# EasyEDA Pro project 高性能信号源.epro

# Schematic Schematic1

## Sheets
1 信号通路: Create Date: 2024-10-18; Page Name: 信号通路; Project Name: 高性能信号源; Schematic Name: Schematic1; Update Date: 2024-10-21; Company: 嘉立创EDA; Page Size: A4; Version: V1.0
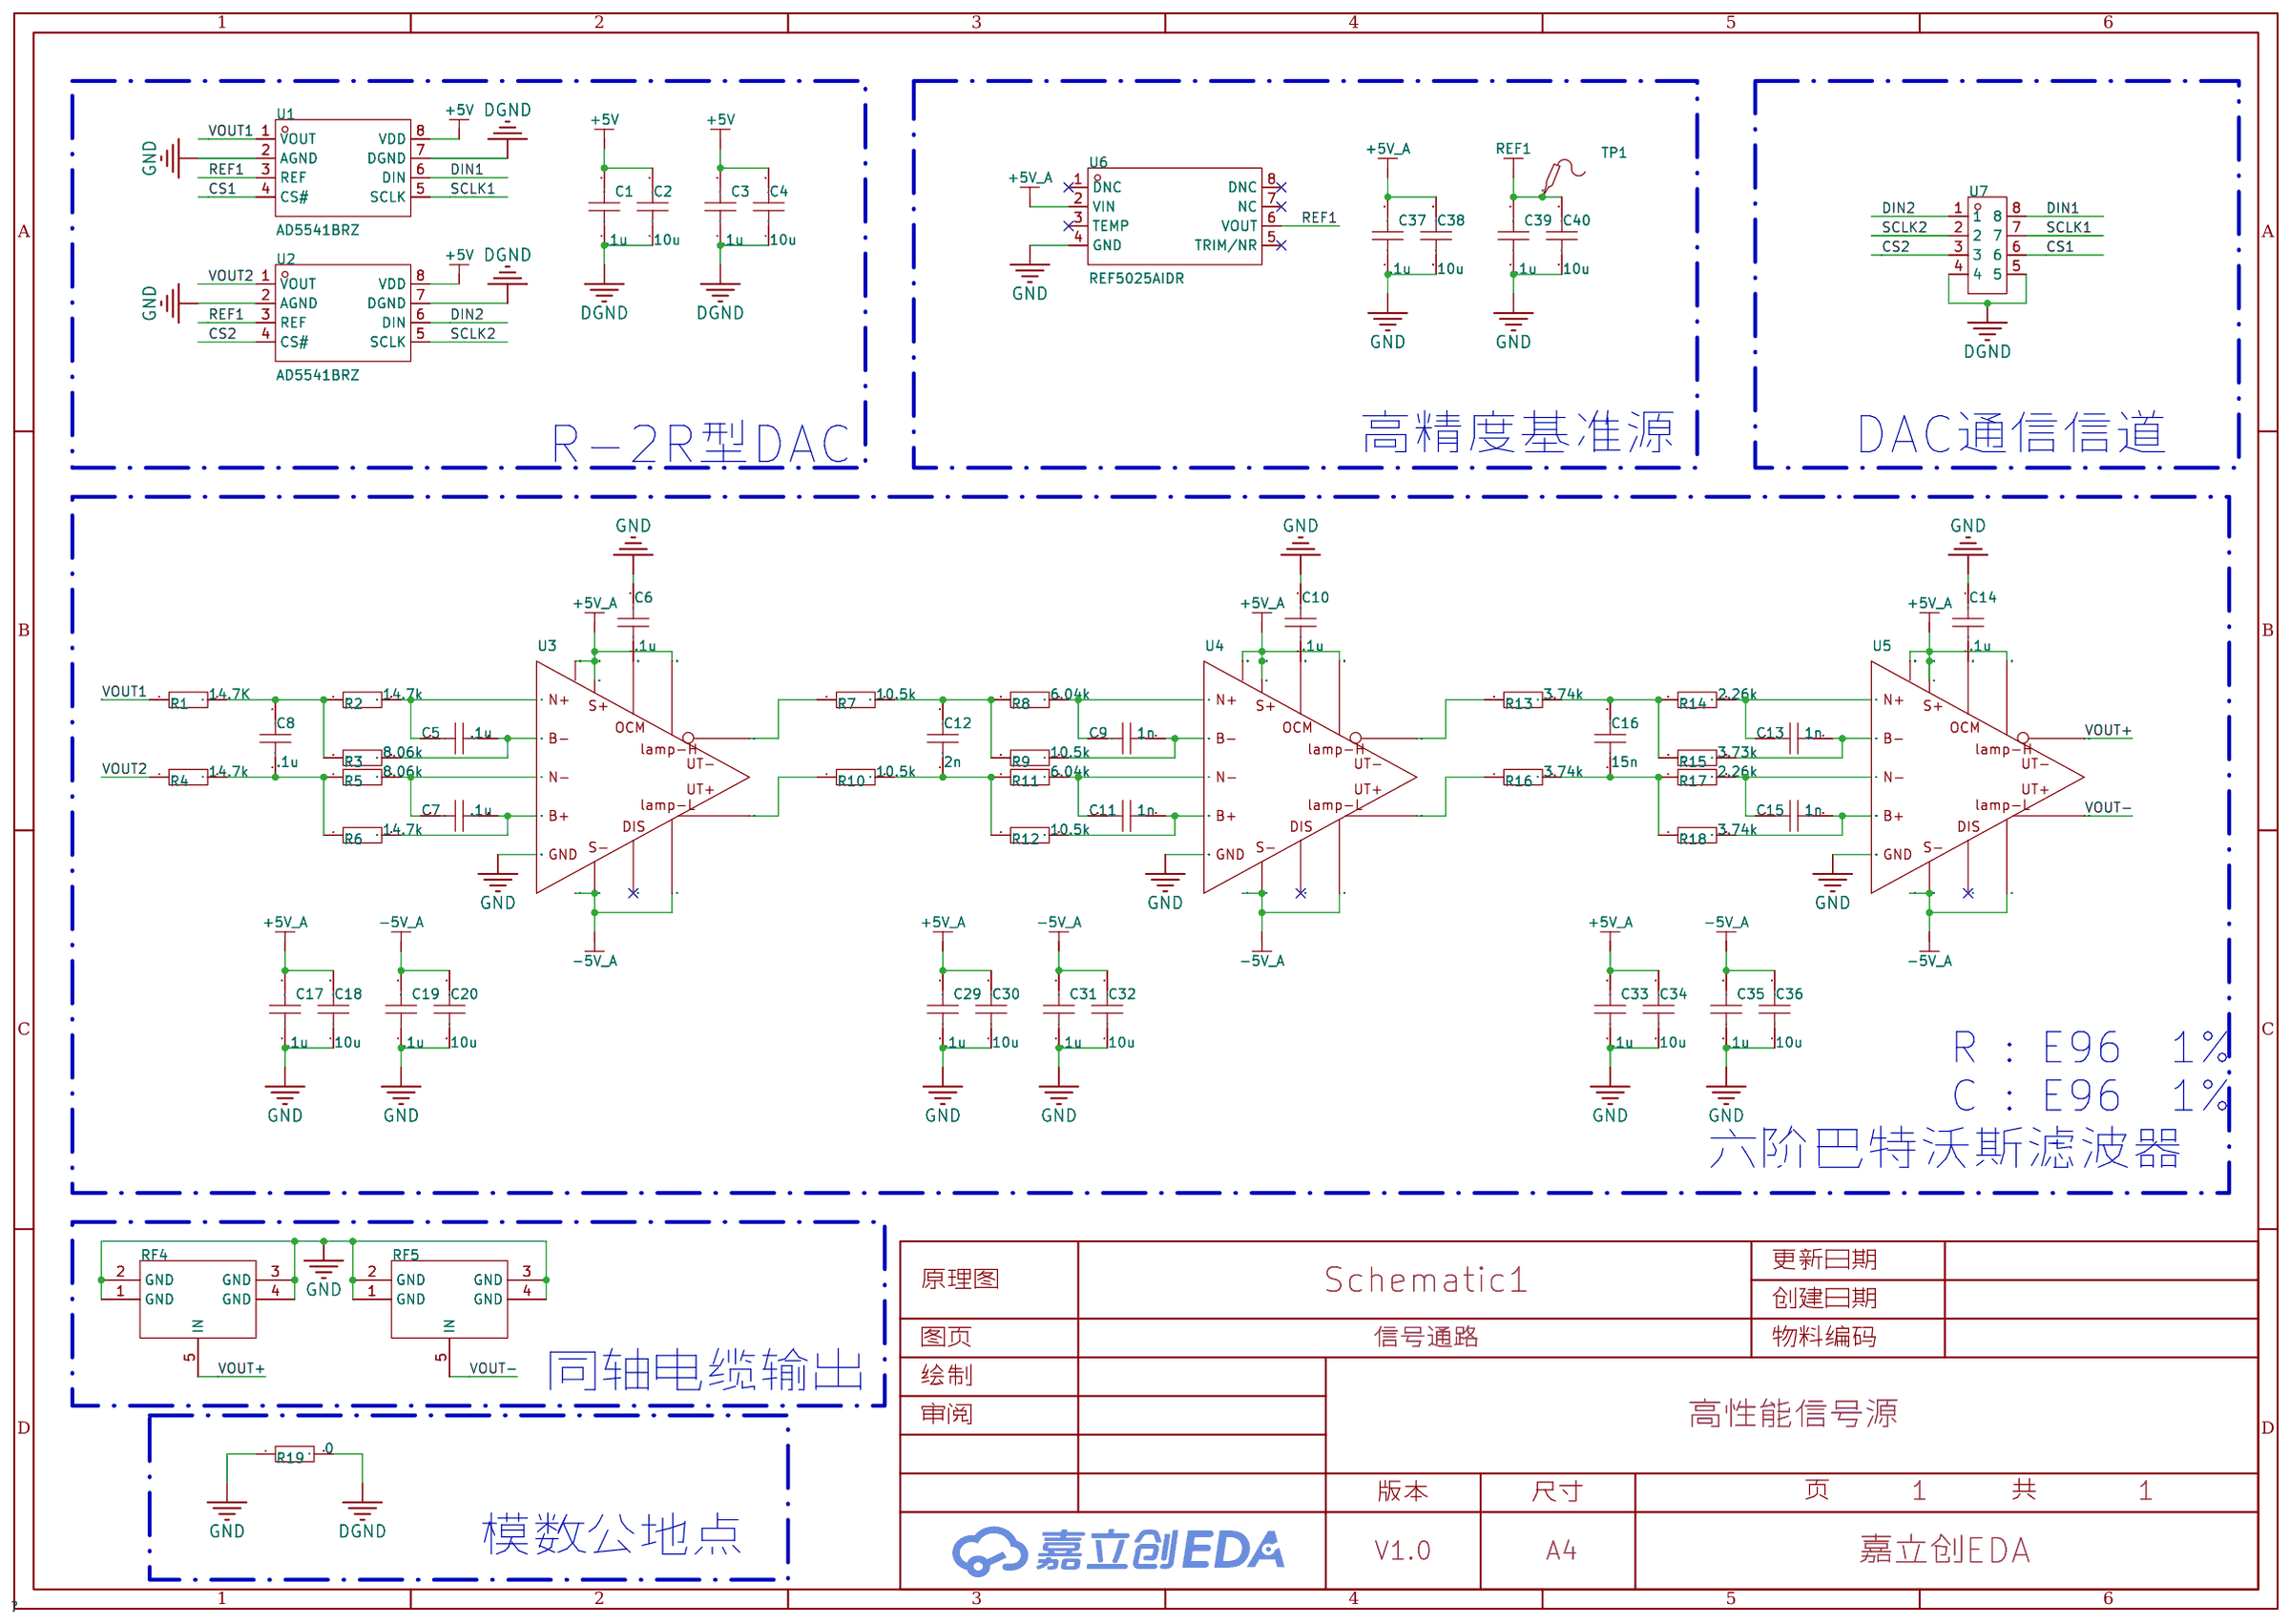
[diagram p0: 信号通路]
2 电源树: Create Date: 2024-10-21; Page Name: 电源树.Schematic1; Update Date: 2024-10-22
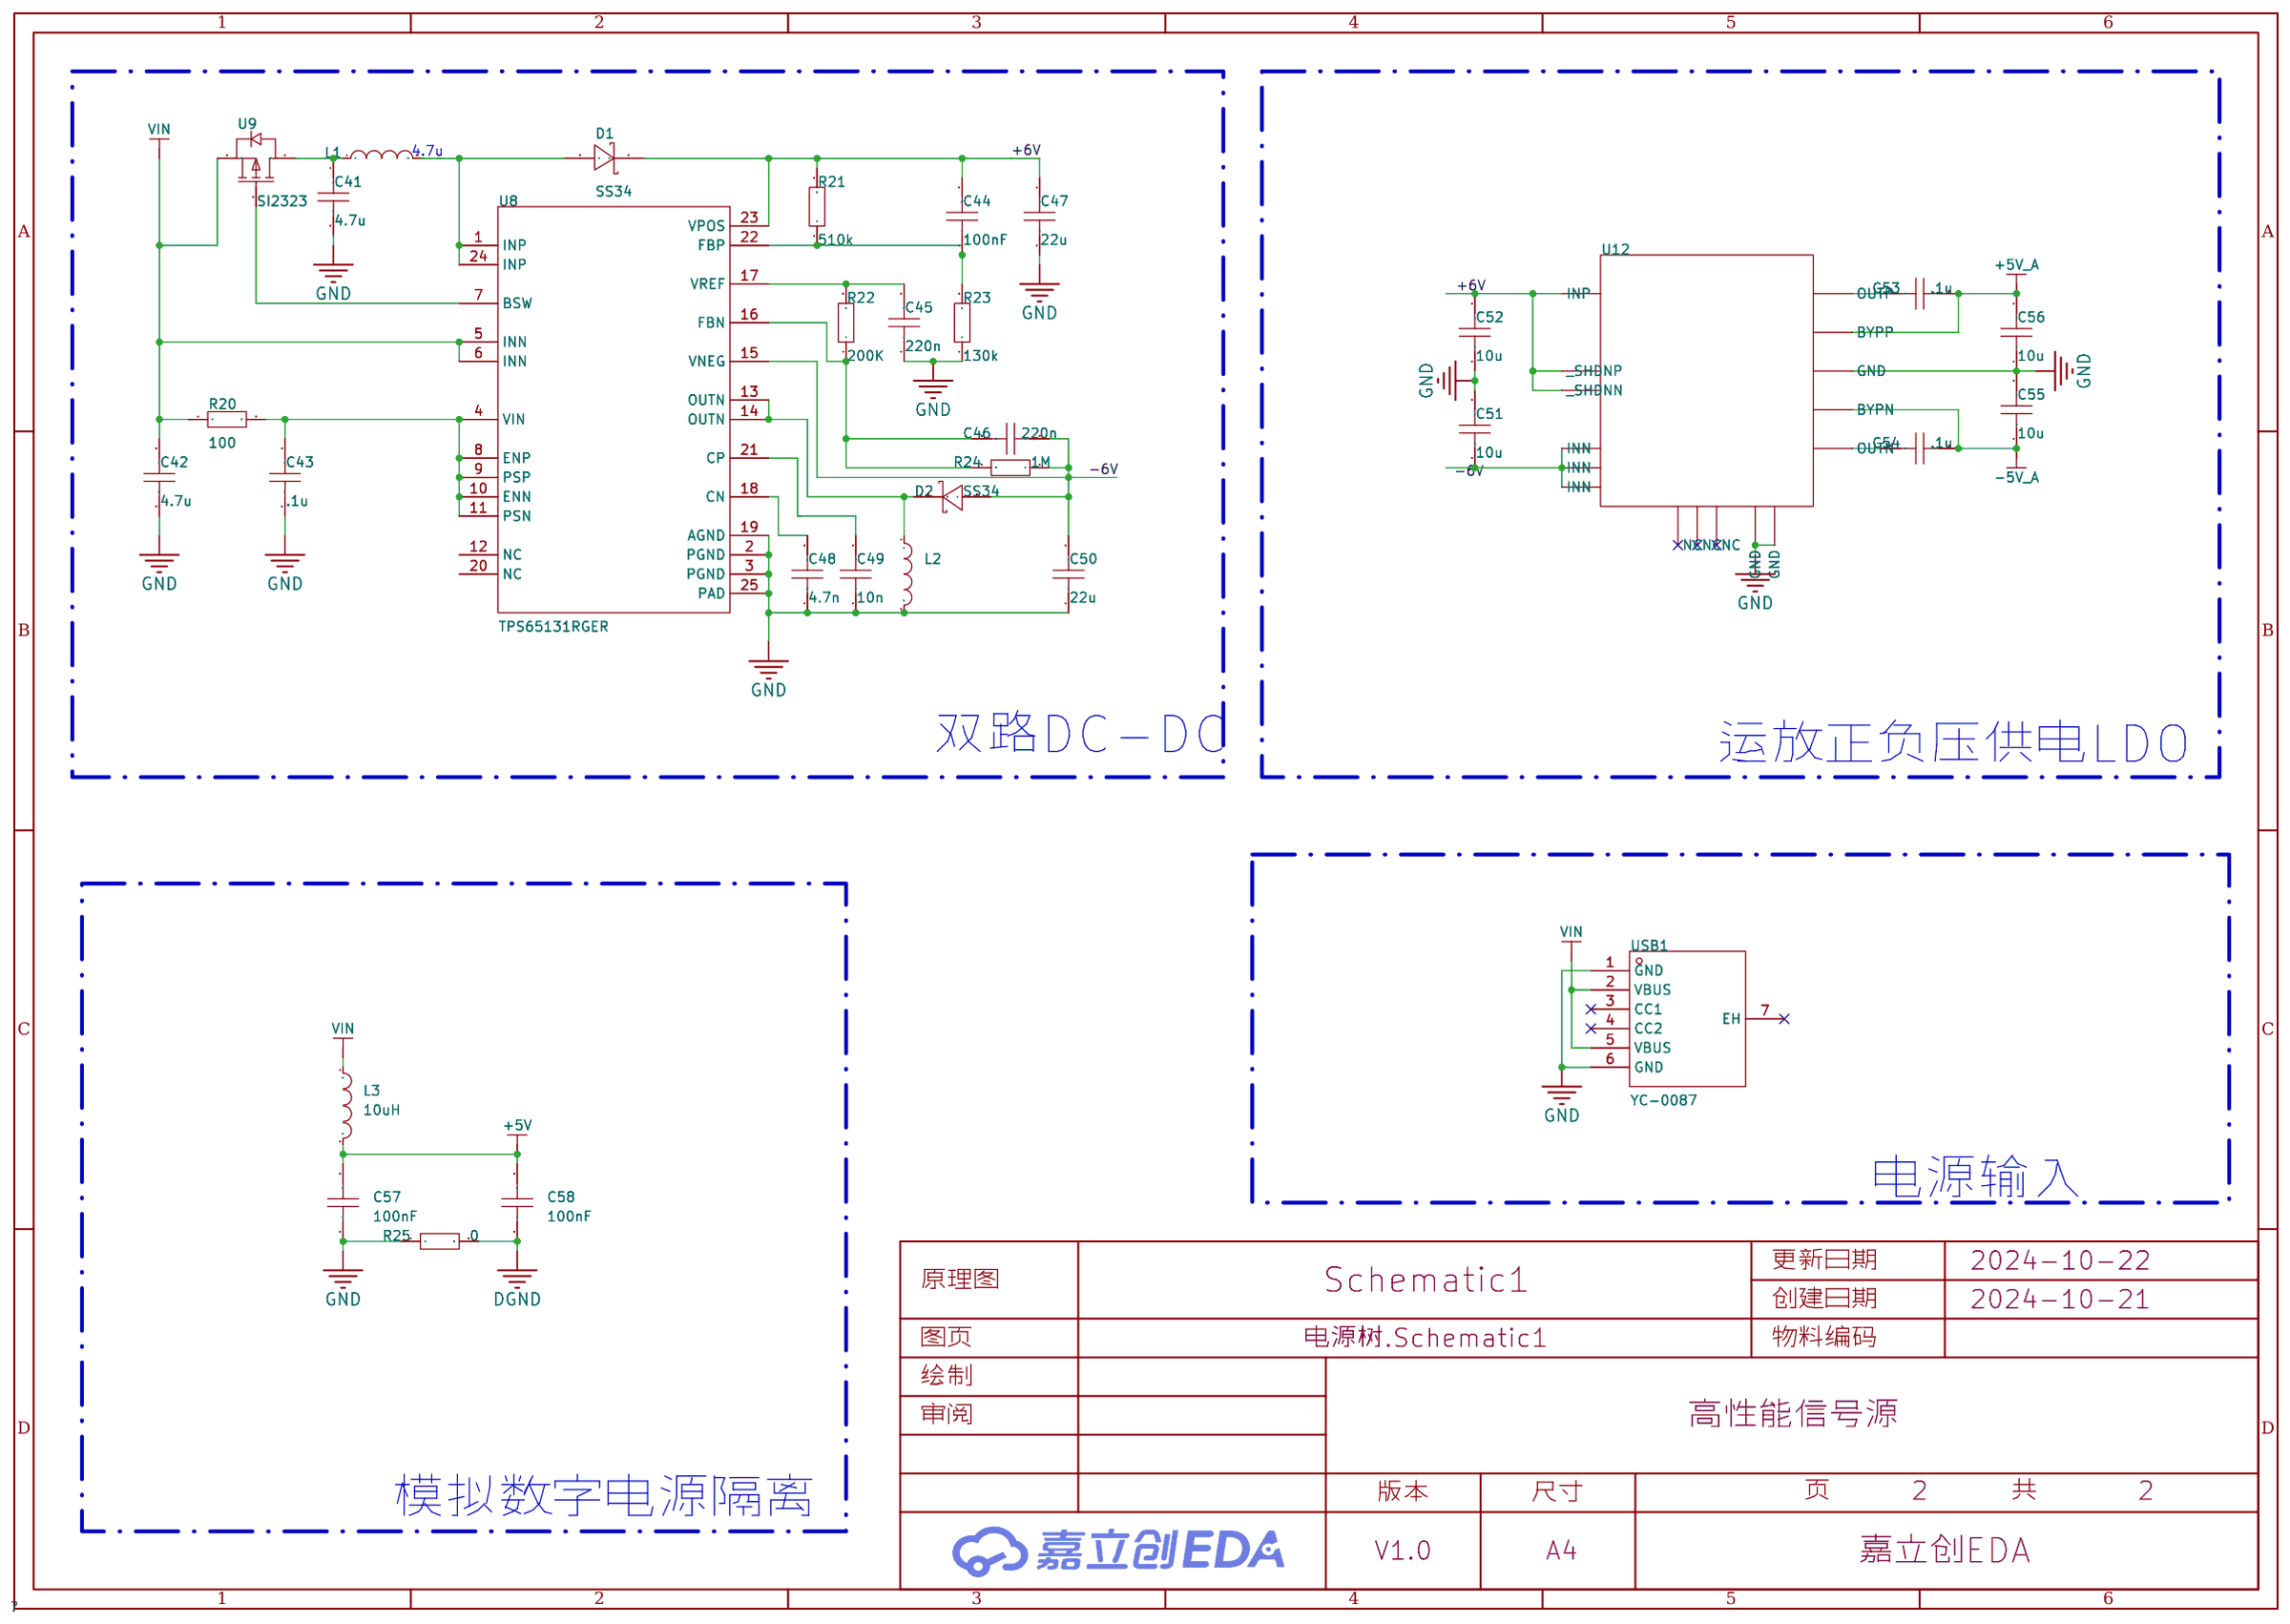
[diagram p1: 电源树]

## Parts
sheet 信号通路
C1  .1u  [C0603]
C2  10u  [C0603]
C3  .1u  [C0603]
C4  10u  [C0603]
C5  .1u  [C0603]
C6  .1u  [C0603]
C7  .1u  [C0603]
C8  .1u  [C0603]
C9  1n  [C0603]
C10  .1u  [C0603]
C11  1n  [C0603]
C12  2n  [C0603]
C13  1n  [C0603]
C14  .1u  [C0603]
C15  1n  [C0603]
C16  15n  [C0603]
C17  .1u  [C0603]
C18  10u  [C0603]
C19  .1u  [C0603]
C20  10u  [C0603]
C29  .1u  [C0603]
C30  10u  [C0603]
C31  .1u  [C0603]
C32  10u  [C0603]
C33  .1u  [C0603]
C34  10u  [C0603]
C35  .1u  [C0603]
C36  10u  [C0603]
C37  .1u  [C0603]
C38  10u  [C0603]
C39  .1u  [C0603]
C40  10u  [C0603]
R1  14.7K  [R0603]
R2  14.7k  [R0603]
R3  8.06k  [R0603]
R4  14.7k  [R0603]
R5  8.06k  [R0603]
R6  14.7k  [R0603]
R7  10.5k  [R0603]
R8  6.04k  [R0603]
R9  10.5k  [R0603]
R10  10.5k  [R0603]
R11  6.04k  [R0603]
R12  10.5k  [R0603]
R13  3.74k  [R0603]
R14  2.26k  [R0603]
R15  3.73k  [R0603]
R16  3.74k  [R0603]
R17  2.26k  [R0603]
R18  3.74k  [R0603]
R19  0  [R0603]
RF4  KH-SMA-K513-G  [ANT-TH_KH-SMA-K513-G]
RF5  KH-SMA-K513-G  [ANT-TH_KH-SMA-K513-G]
TP1  -  [Test-Point-0.5mm]
U1  AD5541BRZ  [SOIC-8_L4.9-W3.9-P1.27-LS6.0-BL]
U2  AD5541BRZ  [SOIC-8_L4.9-W3.9-P1.27-LS6.0-BL]
U3  -  [LFCSP-16_L3.0-W3.0-P0.50-TL-EP1.6-1]
U4  -  [LFCSP-16_L3.0-W3.0-P0.50-TL-EP1.6-1]
U5  -  [LFCSP-16_L3.0-W3.0-P0.50-TL-EP1.6-1]
U6  REF5025AIDR  [SOIC-8_L4.9-W3.9-P1.27-LS6.0-BL]
U7  -  [母针座2.54 2X4]
sheet 电源树
C41  4.7u  [C0603]
C42  4.7u  [C0603]
C43  .1u  [C0603]
C44  100nF  [C0603]
C45  220n  [C0603]
C46  220n  [C0603]
C47  22u  [C0805]
C48  4.7n  [C0805]
C49  10n  [C0805]
C50  22u  [C0805]
C51  10u  [C0603]
C52  10u  [C0603]
C53  .1u  [C0603]
C54  .1u  [C0603]
C55  10u  [C0603]
C56  10u  [C0603]
C57  100nF  [C0603]
C58  100nF  [C0603]
D1  SS34  [SMA_L4.3-W2.6-LS5.2-RD]
D2  SS34  [SMA_L4.3-W2.6-LS5.2-RD]
L1  -  [IND-SMD_L7.1-W6.6]
L2  -  [IND-SMD_L7.1-W6.6]
L3  10uH  [L0603]
R20  100  [R0603]
R21  510k  [R0603]
R22  200K  [R0603]
R23  130k  [R0603]
R24  1M  [R0603]
R25  0  [R0603]
U8  TPS65131RGER  [QFN-24_L4.0-W4.0-P0.50-TL-EP2.6]
U9  SI2323  [SOT-23-3_L2.9-W1.6-P1.90-LS2.8-BR]
U12  -  [DFN-14_L4.0-W3.0-P0.50-BL-EP_LT3032MPDE-PBF]
USB1  YC-0087  [type-c-smd_type-c-6p-3]

## Library data of the parts
C1-C20 C29-C46 C51-C58 = CAP_0603: Supplier Footprint: 0603
R1-R25 = Res_0603: Supplier Footprint: 0603
RF4 RF5 = KH-SMA-K513-G: 连接器类型:板端;接口类型:内孔;端口数量:1;接口直径:-;接口长度/高度:-;频率-最大值:6GHz;射频系列:SMA;阻抗:50Ω;样式:弯头;工作温度范围:-55℃~+155℃;; LCSC Part Name: SMA 内孔 弯头; Supplier Part: C411575; Manufacturer: kinghelm(金航标); Supplier Footprint: 插件; JLCPCB Part Class: 扩展库; Datasheet: https://atta.szlcsc.com/upload/public/pdf/source/20210317/C411575_49039CD64129040639EC5218E5A2C783.pdf; Supplier: LCSC; Connector Type: 板端; Interface Type: 内孔; Number of Ports: 1; Frequency-Max: 6GHz; RF Series: SMA; Impedance: 50Ω; Style: 弯头; Operating Temperature Range: -55℃~+155℃
TP1 = Test-Point: Test Point 测试点
U1 U2 = AD5541BRZ: 接口:DSP；SPI;电源电压:2.7V~5.5V;分辨率:16位;INL/DNL:±0.5LSB；±0.5LSB;稳定时间:1us;; Supplier Part: C578212; Manufacturer: ADI(亚德诺); Supplier Footprint: SOIC-8; JLCPCB Part Class: 扩展库; Datasheet: https://atta.szlcsc.com/upload/public/pdf/source/20200720/C649795_5D512B206C8637CEAE7C18B6DAEE7C2A.pdf; Supplier: LCSC; Interface: DSP；SPI; Output Type: 电压-非缓冲; Supply Voltage: 2.7V~5.5V; Resolution: 16位; Integral nonlinearity: ±0.5LSB；±0.5LSB; Settling Time: 1us; Operating Temperature: -40℃~+85℃
U3-U5 = ADA4945-HP
U6 = REF5025AIDR: 输出类型:固定;输入电压:2.7V~18V;输出电压:2.5V;输出电流:10mA;精度:±0.1%;; Supplier Part: C11341; Manufacturer: TI(德州仪器); Supplier Footprint: SOIC-8; JLCPCB Part Class: 扩展库; Datasheet: https://www.ti.com/cn/lit/gpn/ref5025; Supplier: LCSC; Output Type: 固定; Input Voltage: 2.7V~18V; Output Voltage: 2.5V; Output Current: 10mA; Tolerance: ±0.1%; Temperature Coefficient: 8ppm/℃; Reference Type: 串联; Supply Current: 1.2mA; Noise - 1/10Hz to 10Hz: 3uVp-p; Operating Temperature: -40℃~+125℃@(Ta)
U7 = 母针座8P-2.54
C47-C50 = CAP_0805: Supplier Footprint: 0805
D1 D2 = SS34_C8678: 二极管配置:独立式;正向压降(Vf):550mV@3A;直流反向耐压(Vr):40V;整流电流:3A;; LCSC Part Name: 电压:40V 电流:3A; Supplier Part: C8678; Manufacturer: MDD(辰达半导体); Supplier Footprint: SMA(DO-214AC); JLCPCB Part Class: 基础库; Datasheet: https://atta.szlcsc.com/upload/public/pdf/source/20230314/A80AE34493C69B89E2F4B1712F433538.pdf; Supplier: LCSC; Diode Configuration: 独立式; Forward Voltage (Vf@If): 550mV@3A; Reverse Voltage (Vr): 40V; Rectified Current: 3A; Reverse Leakage Current (Ir): 500uA@40V
L1 L2 = 0630功率电感: LCSC Part Name: 47uH ±20% 1.5A; Supplier Part: C2886270; Manufacturer: PROD(谱罗德); Manufacturer Part: PSPMAA0603H-470M-ANF; LCSC On Sale: 1; Supplier Footprint: SMD,6.6x7.1x3.0mm; Price: 0.771; JLCPCB Part Class: Extended Part; JLCPCB On Sale: 0; Datasheet: https://atta.szlcsc.com/upload/public/pdf/source/20210820/C7C2872A71B38748F9C1646E078B227C.pdf; Supplier: LCSC
L3 = L_0603
U8 = TPS65131
U9 = SI2323DDS: Supplier Part: C5123948; Manufacturer: TECH PUBLIC(台舟); Supplier Footprint: SOT-23-3; JLCPCB Part Class: 扩展库; Datasheet: https://atta.szlcsc.com/upload/public/pdf/source/20220809/D356CCD2BF253A3A6547E7F2CBB03569.pdf; Supplier: LCSC
U12 = LT3032
USB1 = YC-0087: Supplier Part: C9900129224; Supplier Footprint: TYPE-C-SMD; JLCPCB Part Class: 扩展库; Supplier: LCSC

## Nets
+5V: C1.2 C2.2 C3.2 C4.2 C57.2 C58.2 L3.2 U1.8(VDD) U2.8(VDD)
+5V_A: C17.2 C18.2 C29.2 C30.2 C33.2 C34.2 C37.2 C38.2 C53.2 C56.2 U3.5(MODE) U3.6(S+) U3.7(S+) U3.8(LAMPH) U4.5(MODE) U4.6(S+) U4.7(S+) U4.8(LAMPH) U5.5(MODE) U5.6(S+) U5.7(S+) U5.8(LAMPH) U6.2(VIN) U12.3(BYPP)
+6V: C44.2 C47.2 C52.2 D1.1(K) R21.2 U8.23(VPOS) U12.10(_SHDNN) U12.12(_SHDNP) U12.14(INP)
-5V_A: C19.2 C20.2 C31.2 C32.2 C35.2 C36.2 C54.2 C55.1 U3.13(LAMPL) U3.14(S-) U3.15(S-) U4.13(LAMPL) U4.14(S-) U4.15(S-) U5.13(LAMPL) U5.14(S-) U5.15(S-) U12.11(BYPN)
-6V: C46.1 C50.2 C51.1 D2.2(A) R24.1 U8.15(VNEG) U12.6(INN) U12.9(INN) U12.16(INN)
DGND: C1.1 C2.1 C3.1 C4.1 C58.1 R19.2 R25.2 U1.7(DGND) U2.7(DGND) U7.4 U7.5
GND: C6.2 C10.2 C14.2 C17.1 C18.1 C19.1 C20.1 C29.1 C30.1 C31.1 C32.1 C33.1 C34.1 C35.1 C36.1 C37.1 C38.1 C39.1 C40.1 C41.2 C42.2 C43.2 C45.1 C47.1 C48.1 C49.1 C50.1 C51.2 C52.1 C55.2 C56.1 C57.1 L2.2 R19.1 R23.1 R25.1 RF4.1(GND) RF4.2(GND) RF4.3(GND) RF4.4(GND) RF5.1(GND) RF5.2(GND) RF5.3(GND) RF5.4(GND) U1.2(AGND) U2.2(AGND) U3.16(GND) U4.16(GND) U5.16(GND) U6.4(GND) U8.2(PGND) U8.3(PGND) U8.19(AGND) U8.25(PAD) U12.4(GND) U12.5(GND) U12.15(GND) USB1.1(GND) USB1.6(GND)
VIN: C42.1 L3.1 R20.1 U8.5(INN) U8.6(INN) U9.2(S) USB1.2(VBUS) USB1.5(VBUS)
CS1: U1.4(CS#) U7.6
CS2: U2.4(CS#) U7.3
DIN1: U1.6(DIN) U7.8
DIN2: U2.6(DIN) U7.1
REF1: C39.2 C40.2 TP1.1 U1.3(REF) U2.3(REF) U6.6(VOUT)
SCLK1: U1.5(SCLK) U7.7
SCLK2: U2.5(SCLK) U7.2
VOUT1: R1.1 U1.1(VOUT)
VOUT2: R4.1 U2.1(VOUT)
VOUT+: RF4.5(IN) U5.11(OUT-)
VOUT-: RF5.5(IN) U5.10(OUT+)
$1N1649: C6.1 U3.9(OCM)
$1N1727: C8.2 R1.2 R2.1 R3.1
$1N1751: C5.1 R2.2 U3.2(IN+)
$1N1761: C5.2 R3.2 U3.1(FB-)
$1N1872: C8.1 R4.2 R5.1 R6.1
$1N1876: C7.1 R5.2 U3.3(IN-)
$1N1880: C7.2 R6.2 U3.4(FB+)
$1N2295: C10.1 U4.9(OCM)
$1N2299: C12.2 R7.2 R8.1 R9.1
$1N2303: C9.1 R8.2 U4.2(IN+)
$1N2308: C9.2 R9.2 U4.1(FB-)
$1N2313: C12.1 R10.2 R11.1 R12.1
$1N2317: C11.1 R11.2 U4.3(IN-)
$1N2322: C11.2 R12.2 U4.4(FB+)
$1N2335: R7.1 U3.11(OUT-)
$1N2345: R10.1 U3.10(OUT+)
$1N2703: C14.1 U5.9(OCM)
$1N2707: C16.2 R13.2 R14.1 R15.1
$1N2711: C13.1 R14.2 U5.2(IN+)
$1N2716: C13.2 R15.2 U5.1(FB-)
$1N2721: C16.1 R16.2 R17.1 R18.1
$1N2725: C15.1 R17.2 U5.3(IN-)
$1N2730: C15.2 R18.2 U5.4(FB+)
$1N2737: R13.1 U4.11(OUT-)
$1N2741: R16.1 U4.10(OUT+)
$2N441: U8.7(BSW) U9.1(G)
$2N487: C41.1 L1.1 U9.3(D)
$2N691: C43.1 R20.2 U8.4(VIN) U8.8(ENP) U8.9(PSP) U8.10(ENN) U8.11(PSN)
$2N838: D1.2(A) L1.2 U8.1(INP) U8.24(INP)
$2N1038: C45.2 R22.2 U8.17(VREF)
$2N1074: C44.1 R21.1 R23.2 U8.22(FBP)
$2N1166: C46.2 R22.1 R24.2 U8.16(FBN)
$2N1575: C48.2 U8.18(CN)
$2N1585: C49.2 U8.21(CP)
$2N1650: D2.1(K) L2.1 U8.13(OUTN) U8.14(OUTN)
$2N3541: C53.1 U12.1(OUTP)
$2N3548: C54.1 U12.7(OUTN)

Not connected (* = marked no-connect by the designer): U3 12(DIS)*; U4 12(DIS)*; U5 12(DIS)*; U6 1(DNC)* 3(TEMP)* 5(TRIM/NR)* 7(NC)* 8(DNC)*; U8 12(NC) 20(NC); U12 2(NC)* 8(NC)* 13(NC)*; USB1 3(CC1)* 4(CC2)* 7(EH)*

## Notes on the sheets
sheet 1
- 高精度基准源
- DAC通信信道
- R-2R型DAC
- R : E96  1%
- C : E96  1%
- 六阶巴特沃斯滤波器
- 同轴电缆输出
- 模数公地点
sheet 2
- 4.7u
- 双路DC-DC
- 运放正负压供电LDO
- 电源输入
- 模拟数字电源隔离

# Board PCB1
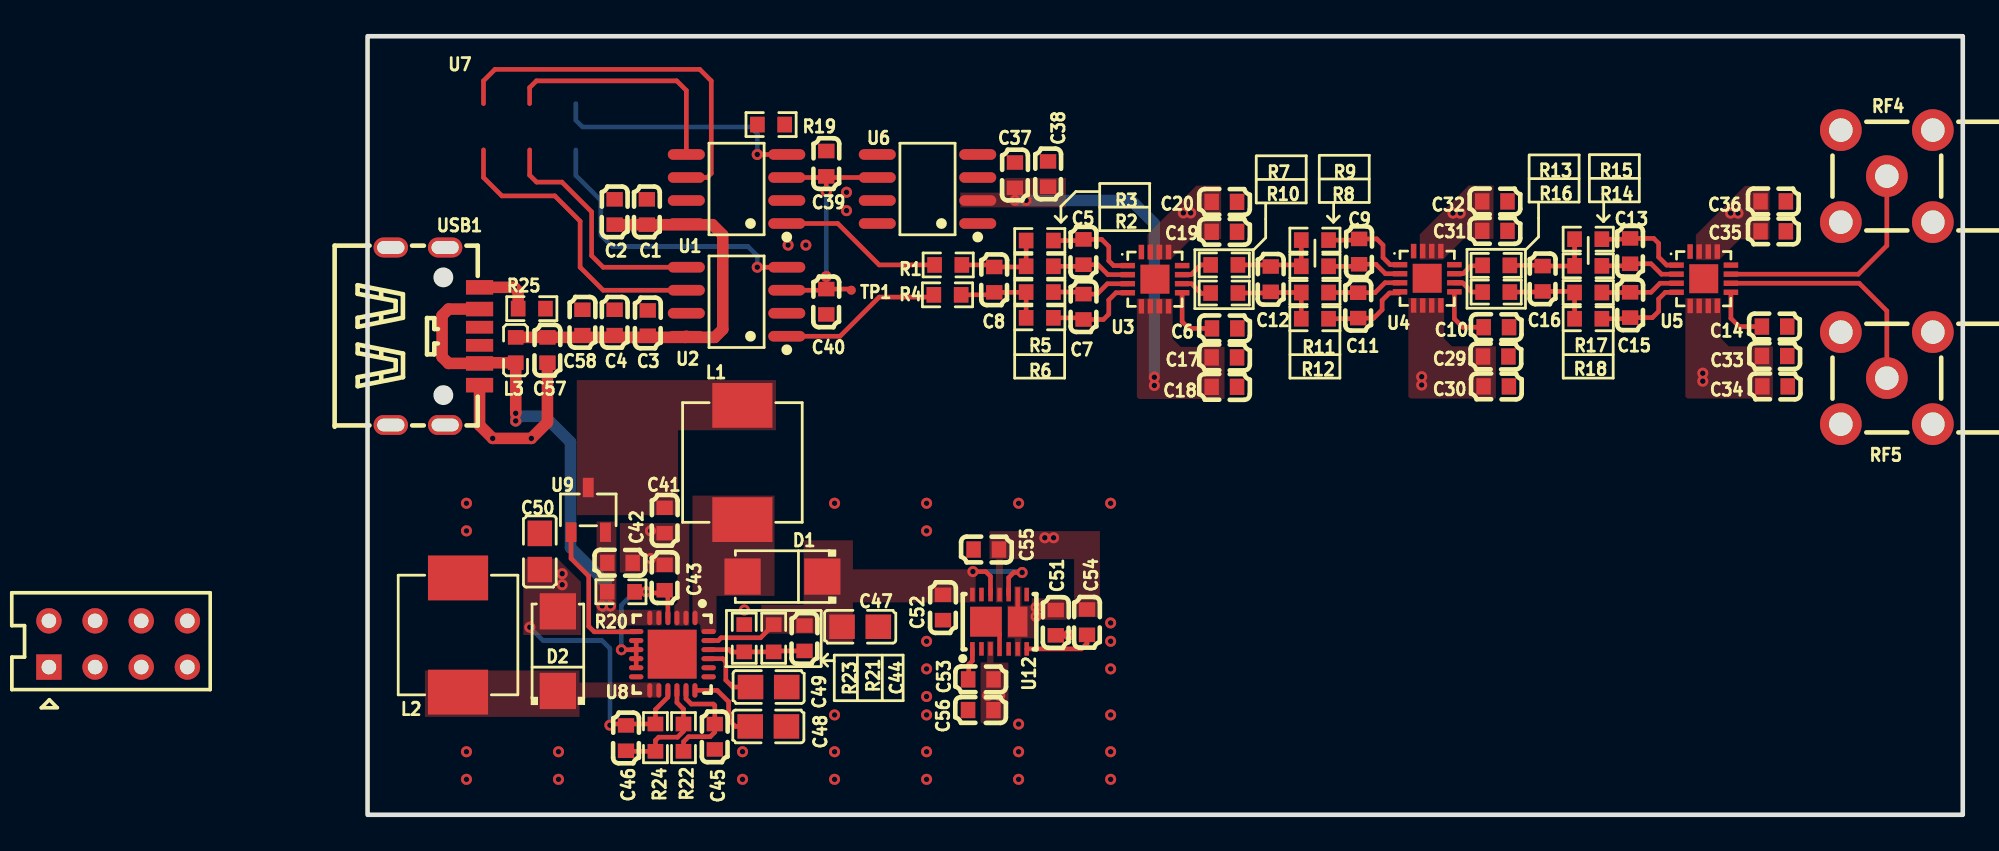
[diagram p2: board, top side]
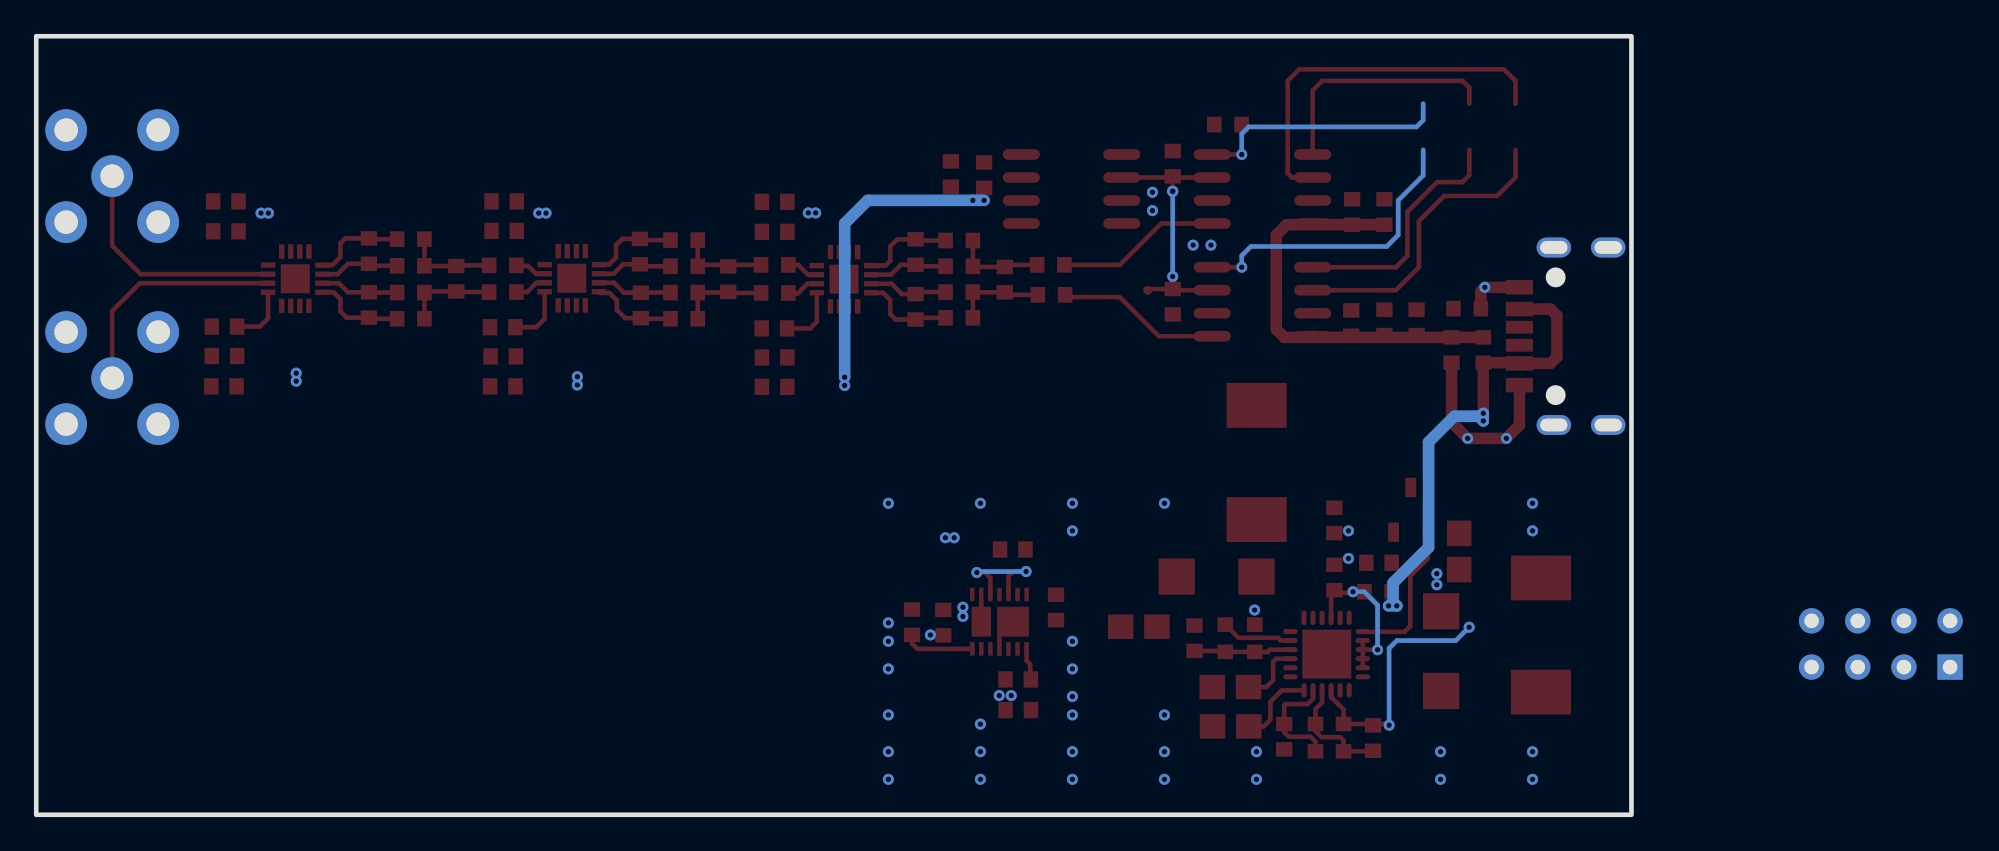
[diagram p3: board, bottom side, seen from below]

Outline 88.06 x 42.98 mm; copper layers: Top Layer, Inner1, Inner2, Bottom Layer. Coordinates in mm from the lower left corner of the outline.
Outline path: rectangle 0,42.98 88.06,0
Stack: Top Layer 0.035mm 外层铜厚1oz / Dielectric1 0.2104mm 7628 RC49% 8.6mil / Inner1 0.0152mm 内层铜厚 / Dielectric2 1.065mm 1.1mm H/HOZ 含铜 / Inner2 0.0152mm 内层铜厚 / Dielectric3 0.2104mm 7628 RC49% 8.6mil / Bottom Layer 0.035mm 外层铜厚1oz

## Design rules (mm)
net VOUT+: DP1
net VOUT-: DP1
template: 自定义配置
spacing copperThickness1oz (default): track to track 0.102, other pairs 0.152 to 0.3
spacing copperThickness2oz: track to track 0.203, other pairs 0.152 to 0.3
track width copperThickness1oz (default): min 0.127, default 0.254, max 2.54
track width copperThickness2oz: min 0.203, default 0.254, max 2.54
differential pair differentialPair (default): width min 0.127, default 0.254, max 2.54; gap min 0.152, default 0.152
via viaSize (default): diameter min 0.5, default 0.61, max 10; hole min 0.3, default 0.305, max 6.3

## Placement (name value [footprint] x y rotation side)
C1  .1u  [C0603]  15.42 33.27 270 top
C2  10u  [C0603]  13.64 33.27 270 top
C3  .1u  [C0603]  15.47 27.14 270 top
C4  10u  [C0603]  13.64 27.18 270 top
C5  .1u  [C0603]  39.52 31.06 90 top
C6  .1u  [C0603]  47.32 26.85 0 top
C7  .1u  [C0603]  39.52 28.04 270 top
C8  .1u  [C0603]  34.59 29.54 90 top
C9  1n  [C0603]  54.74 31.09 90 top
C10  .1u  [C0603]  62.31 26.92 0 top
C11  1n  [C0603]  54.69 28.12 270 top
C12  2n  [C0603]  49.86 29.57 90 top
C13  1n  [C0603]  69.7 31.12 90 top
C14  .1u  [C0603]  77.67 26.95 0 top
C15  1n  [C0603]  69.7 28.14 270 top
C16  15n  [C0603]  64.87 29.59 90 top
C17  .1u  [C0603]  47.3 25.25 180 top
C18  10u  [C0603]  47.3 23.62 180 top
C19  .1u  [C0603]  47.3 32.18 180 top
C20  10u  [C0603]  47.3 33.83 180 top
C29  .1u  [C0603]  62.28 25.3 180 top
C30  10u  [C0603]  62.31 23.65 180 top
C31  .1u  [C0603]  62.23 32.23 180 top
C32  10u  [C0603]  62.23 33.86 180 top
C33  .1u  [C0603]  77.67 25.32 180 top
C34  10u  [C0603]  77.7 23.65 180 top
C35  .1u  [C0603]  77.6 32.21 180 top
C36  10u  [C0603]  77.6 33.86 180 top
C37  .1u  [C0603]  35.74 35.31 270 top
C38  10u  [C0603]  37.57 35.37 270 top
C39  .1u  [C0603]  25.32 35.94 270 top
C40  10u  [C0603]  25.32 28.32 90 top
C41  4.7u  [C0603]  16.4 16.25 270 top
C42  4.7u  [C0603]  13.94 13.91 0 top
C43  .1u  [C0603]  16.4 13.1 90 top
C44  100nF  [C0603]  24.12 9.74 90 top
C45  220n  [C0603]  19.17 4.31 90 top
C46  220n  [C0603]  14.27 4.23 270 top
C47  22u  [C0805]  27.2 10.38 180 top
C48  4.7n  [C0805]  22.12 4.88 180 top
C49  10n  [C0805]  22.14 7.05 180 top
C50  22u  [C0805]  9.51 14.53 270 top
C51  10u  [C0603]  37.99 10.61 270 top
C52  10u  [C0603]  31.77 11.44 90 top
C53  .1u  [C0603]  33.86 7.47 0 top
C54  .1u  [C0603]  39.72 10.63 90 top
C55  10u  [C0603]  34.15 14.64 180 top
C56  10u  [C0603]  33.85 5.78 0 top
C57  100nF  [C0603]  9.93 25.65 90 top
C58  100nF  [C0603]  11.86 27.18 270 top
D1  SS34  [SMA_L4.3-W2.6-LS5.2-RD]  22.9 13.15 180 top
D2  SS34  [SMA_L4.3-W2.6-LS5.2-RD]  10.51 9.03 90 top
L1  -  [IND-SMD_L7.1-W6.6]  20.69 19.45 90 top
L2  -  [IND-SMD_L7.1-W6.6]  5 9.92 270 top
L3  10uH  [L0603]  8.18 25.65 90 top
R1  14.7K  [R0603]  32.05 30.35 0 top
R2  14.7k  [R0603]  37.11 30.28 0 top
R3  8.06k  [R0603]  37.11 31.7 0 top
R4  14.7k  [R0603]  32.02 28.7 0 top
R5  8.06k  [R0603]  37.11 28.85 0 top
R6  14.7k  [R0603]  37.11 27.43 0 top
R7  10.5k  [R0603]  47.3 30.35 0 top
R8  6.04k  [R0603]  52.3 30.28 0 top
R9  10.5k  [R0603]  52.3 31.72 0 top
R10  10.5k  [R0603]  47.3 28.8 0 top
R11  6.04k  [R0603]  52.3 28.83 0 top
R12  10.5k  [R0603]  52.3 27.38 0 top
R13  3.74k  [R0603]  62.31 30.33 0 top
R14  2.26k  [R0603]  67.39 30.3 0 top
R15  3.73k  [R0603]  67.39 31.78 0 top
R16  3.74k  [R0603]  62.31 28.85 0 top
R17  2.26k  [R0603]  67.39 28.83 0 top
R18  3.74k  [R0603]  67.39 27.38 0 top
R19  0  [R0603]  22.28 38.1 180 top
R20  100  [R0603]  13.99 12.31 0 top
R21  510k  [R0603]  22.42 9.74 90 top
R22  200K  [R0603]  17.44 4.26 270 top
R23  130k  [R0603]  20.8 9.74 270 top
R24  1M  [R0603]  15.89 4.26 270 top
R25  0  [R0603]  9.07 27.94 0 top
RF4  KH-SMA-K513-G  [ANT-TH_KH-SMA-K513-G]  83.87 35.26 180 top
RF5  KH-SMA-K513-G  [ANT-TH_KH-SMA-K513-G]  83.87 24.1 180 top
TP1  -  [Test-Point-0.5mm]  26.7 28.96 0 top
U1  AD5541BRZ  [SOIC-8_L4.9-W3.9-P1.27-LS6.0-BL]  20.37 34.54 90 top
U2  AD5541BRZ  [SOIC-8_L4.9-W3.9-P1.27-LS6.0-BL]  20.37 28.32 90 top
U3  -  [LFCSP-16_L3.0-W3.0-P0.50-TL-EP1.6-1]  43.47 29.57 0 top
U4  -  [LFCSP-16_L3.0-W3.0-P0.50-TL-EP1.6-1]  58.5 29.62 0 top
U5  -  [LFCSP-16_L3.0-W3.0-P0.50-TL-EP1.6-1]  73.76 29.59 0 top
U6  REF5025AIDR  [SOIC-8_L4.9-W3.9-P1.27-LS6.0-BL]  30.91 34.54 90 top
U7  -  [母针座2.54 2X4]  17.07 23.75 90 top
U8  TPS65131RGER  [QFN-24_L4.0-W4.0-P0.50-TL-EP2.6]  16.83 8.87 270 top
U9  SI2323  [SOT-23-3_L2.9-W1.6-P1.90-LS2.8-BR]  12.18 16.83 270 top
U12  -  [DFN-14_L4.0-W3.0-P0.50-BL-EP_LT3032MPDE-PBF]  34.89 10.66 0 top
USB1  YC-0087  [type-c-smd_type-c-6p-3]  3.73 26.42 270 top

## Footprints (pads in the part's own frame, mm; a bottom-side part is the same pattern mirrored in y, then rotated)
ANT-TH_KH-SMA-K513-G
  round 2.3 hole 1.3: 1(-2.54,-2.54) 2(-2.54,2.54) 3(2.54,2.54) 4(2.54,-2.54) 5(0,0)
C0603
  rect 0.8x0.9 smd: 1(-0.7,0) 2(0.7,0)
C0805
  rect 1.41x1.35 smd: 1(-1,0) 2(1,0)
DFN-14_L4.0-W3.0-P0.50-BL-EP_LT3032MPDE-PBF
  rect 0.25x0.75 smd: 1(-1.5,-1.5) 2(-1,-1.5) 3(-0.5,-1.5) 5(0.5,-1.5) 6(1,-1.5) 7(1.5,-1.5) 8(1.5,1.5) 10(0.5,1.5) 11(0,1.5) 12(-0.5,1.5) 13(-1,1.5) 14(-1.5,1.5)
  rect 0.25x1.3 smd: 4(0,-1.25) 9(1,1.25)
  rect 1.75x1.65 smd: 15(-0.75,0)
  rect 1.07x1.65 smd: 16(1,0)
IND-SMD_L7.1-W6.6
  rect 2.474x3.32 smd: 1(3.152,0) 2(-3.152,0)
L0603
  rect 0.8x0.864 smd: 1(-0.7,0) 2(0.7,0)
LFCSP-16_L3.0-W3.0-P0.50-TL-EP1.6-1
  rect 0.8x0.3 smd: 1(-1.5,0.75) 2(-1.5,0.25) 3(-1.5,-0.249) 4(-1.5,-0.75) 9(1.5,-0.75) 10(1.5,-0.249) 11(1.5,0.25) 12(1.5,0.75)
  rect 0.3x0.8 smd: 5(-0.75,-1.5) 6(-0.25,-1.5) 7(0.25,-1.5) 8(0.751,-1.498) 13(0.75,1.5) 14(0.25,1.5) 15(-0.25,1.5) 16(-0.75,1.5)
  rect 1.6x1.6 smd: 17(0,0)
QFN-24_L4.0-W4.0-P0.50-TL-EP2.6
  oval 0.8x0.28 smd: 1(-2,1.25) 2(-2,0.75) 3(-2,0.25) 4(-2,-0.25) 5(-2,-0.75) 6(-2,-1.25) 13(2,-1.25) 14(2,-0.75) 15(2,-0.25) 16(2,0.25) 17(2,0.75) 18(2,1.242)
  oval 0.28x0.8 smd: 7(-1.25,-2) 8(-0.75,-2) 9(-0.25,-2) 10(0.25,-2) 11(0.75,-2) 12(1.25,-2) 19(1.25,2) 20(0.75,2) 21(0.25,2) 22(-0.25,2) 23(-0.75,2) 24(-1.25,2)
  rect 2.7x2.7 smd: 25(0,-0.013)
R0603
  rect 0.806x0.864 smd: 1(-0.753,0) 2(0.753,0)
SMA_L4.3-W2.6-LS5.2-RD
  rect 2x2 smd: 1(-2.2,0) 2(2.2,0)
SOIC-8_L4.9-W3.9-P1.27-LS6.0-BL
  oval 0.588x2.045 smd: 1(-1.905,-2.772) 2(-0.635,-2.772) 3(0.635,-2.772) 4(1.905,-2.772) 5(1.905,2.772) 6(0.635,2.772) 7(-0.635,2.772) 8(-1.905,2.772)
SOT-23-3_L2.9-W1.6-P1.90-LS2.8-BR
  rect 1.07x0.6 smd: 1(1.235,-0.95) 2(1.235,0.95) 3(-1.235,0)
Test-Point-0.5mm
  round 0.5 smd: 1(0,0)
type-c-smd_type-c-6p-3
  rect 0.8x1.5 smd: 1(-2.7,2.45) 2(-1.5,2.45) 5(1.5,2.45) 6(2.7,2.45)
  rect 0.7x1.5 smd: 3(-0.5,2.45) 4(0.5,2.45)
  oval 1.1x1.9 hole 0.7x1.5: 7(-4.9,0.55) 7(-4.9,-2.45) 7(4.9,0.55) 7(4.9,-2.45)
母针座2.54 2X4
  rect 1.4x1.4 hole 0.8: 1(-15.595,34.658)
  round 1.4 hole 0.8: 2(-15.595,32.11) 3(-15.595,29.561) 4(-15.595,27.013) 5(-13.043,27.013) 6(-13.043,29.561) 7(-13.043,32.11) 8(-13.043,34.658)

## Nets
As in the schematic.

Pads without a net: U3 12 17; U4 12 17; U5 12 17; U6 1 3 5 7 8; U8 12 20; U12 2 8 13; USB1 3 4 7

## Via types
v1: diameter 0.61, hole 0.305, Top Layer to Bottom Layer, 79 vias

## Routing (per net, layer and track width the routed paths; a pad name or vN(x,y) marks a point on that pad's centre or on a via; arc(x,y) is an arc through that point)
+5V: length 23.1
  Top Layer w0.635: L3.2 17.54,26.35 ; 17.54,26.35 U2.8 ; 17.54,26.35 19.17,26.35 19.61,26.8 19.61,32 19.04,32.57 C1.2 C2.2
+5V_A: length 73.8
  Inner2 w0.635: v1(73.71,24.38) v1(73.71,23.94) 58.44,23.94 v1(58.19,24.18) 57.96,23.95 43.69,23.95 ; 43.69,23.95 v1(43.43,23.7) 43.43,7.54 42.47,6.58 v1(34.9,6.58) v1(34.24,6.58) ; 43.69,23.95 43.64,23.95 v1(43.43,24.16)
  Bottom Layer w0.635: v1(43.43,24.16) 43.43,32.64 42.16,33.92 v1(36.36,33.92) v1(35.74,33.92)
  vias: v1(58.19,23.72)
+6V: length 10.5
  Top Layer w0.254: v1(36.14,13.37) 35.68,13.37 35.39,13.09 U12.10 ; 33.47,13.43 34.13,13.43 34.39,13.16 U12.12 ; U8.23 19.36,9.62 19.51,9.77 21.69,9.77 R21.2
  Bottom Layer w0.254: v1(36.14,13.37) 36.09,13.43 v1(33.42,13.43)
-5V_A: length 54.4
  Inner2 w0.635: 75.69,33.21 v1(75.25,33.21) v1(60.33,33.21) ; v1(60.33,33.21) 60.31,33.22 v1(45.44,33.22) v1(45.03,33.22) 41.81,30 41.81,15.82 41.27,15.29 v1(37.87,15.29) v1(37.39,15.29) ; v1(60.33,33.21) v1(59.92,33.21)
  vias: v1(75.65,33.21)
-6V: length 42.2
  Top Layer w0.254: U8.15 16.58,6.49 15.89,5.81 R24.1 14.35,5.01 ; v1(13.38,4.94) 13.45,5.01 14.35,5.01 ; 14.35,5.01 C46.1
  Inner2 w0.635: v1(10.74,12.7) v1(10.74,13.31) 10.97,13.08 29.18,13.08 31.11,11.15 36.7,11.15 v1(36.91,10.95) v1(36.91,11.46)
  Bottom Layer w0.254: v1(13.38,4.94) 13.38,9.19 12.95,9.62 9.69,9.62 v1(8.96,10.35)
GND: length 13.1
  Top Layer w0.635: C57.1 9.93,21.67 v1(9.04,20.78) v1(6.91,20.78) 6.18,21.5 USB1.6 ; R25.1 8.31,28.9 v1(8.1,29.12) USB1.1
  vias: v1(5.46,17.2) v1(5.46,15.67) v1(5.46,3.48) v1(5.46,1.96) v1(10.54,3.48) v1(10.54,1.96) v1(15.62,15.67) v1(15.62,14.15) v1(20.7,3.48) v1(20.7,1.96) v1(20.8,11.3) v1(23.22,31.45) v1(24.2,31.45) v1(25.78,17.2) v1(25.78,5.51) v1(25.78,3.48) v1(25.78,1.96) v1(26.44,34.36) v1(26.44,33.35) v1(30.86,17.2) v1(30.86,15.67) v1(30.86,9.58) v1(30.86,8.05) v1(30.86,6.53) v1(30.86,5.51) v1(30.86,3.48) v1(30.86,1.96) v1(35.94,17.2) v1(35.94,5) v1(35.94,3.48) v1(35.94,1.96) v1(38.7,9.93) v1(41.02,17.2) v1(41.02,10.59) v1(41.02,9.58) v1(41.02,8.05) v1(41.02,5.51) v1(41.02,3.48) v1(41.02,1.96)
VIN: length 26.1
  Top Layer w0.635: v1(8.18,22.16) L3.1 6.22,24.95 USB1.5 4.47,24.92 4.11,25.27 4.11,27.56 4.47,27.92 USB1.2
  Bottom Layer w0.635: v1(8.18,22.16) v1(8.18,21.74) 8.43,22 9.78,22 11.2,20.57 11.2,14.76 13.16,12.8 13.16,11.73 v1(12.95,11.53) v1(13.41,11.53)
CS1: length 14
  Top Layer w0.254: U1.4 v1(21.51,36.45)
  Bottom Layer w0.254: v1(21.51,36.45) 21.51,37.59 21.13,37.97 11.86,37.97 11.5,38.34 11.5,39.26
CS2: length 16.6
  Top Layer w0.254: U2.4 v1(21.51,30.23)
  Bottom Layer w0.254: v1(21.51,30.23) 21.51,30.86 21.01,31.37 13.51,31.37 12.88,32 12.88,33.91 11.5,35.29 11.5,36.7
DIN1: length 20.9
  Top Layer w0.254: U1.6 18.75,35.18 18.97,35.41 18.97,40.51 18.34,41.15 7.04,41.15 6.4,40.51 6.4,39.26
DIN2: length 16.8
  Top Layer w0.254: 6.4,36.7 6.4,35.18 7.42,34.16 10.34,34.16 11.73,32.77 11.73,30.23 13,28.96 U2.6
REF1: length 14.2
  Top Layer w0.254: v1(25.32,34.42) 25.32,35.18 ; 25.32,35.18 C39.2 ; 25.32,35.18 U1.3 ; 25.32,35.18 25.39,35.18 25.45,35.24 25.51,35.18 U6.6 ; U2.3 25.26,28.96 25.32,29.02 26.64,29.02 TP1.1
  Bottom Layer w0.254: v1(25.32,34.42) v1(25.32,29.71)
SCLK1: length 13.4
  Top Layer w0.254: U1.5 17.6,39.98 17.07,40.51 9.32,40.51 8.95,40.14 8.95,39.26
SCLK2: length 13.6
  Top Layer w0.254: 8.95,36.7 8.95,35.31 9.33,34.93 10.73,34.93 12.37,33.28 12.37,30.86 13,30.23 U2.5
VOUT1: length 9
  Top Layer w0.254: 31.17,30.35 28.24,30.35 25.96,32.64 U1.1
VOUT2: length 9.1
  Top Layer w0.254: U2.1 26.09,26.42 28.24,28.58 31.14,28.58 R4.1
VOUT+: length 13.1
  Top Layer w0.254: RF4.5 83.87,31.42 82.29,29.84 U5.11
VOUT-: length 13
  Top Layer w0.254: RF5.5 83.87,27.81 82.34,29.34 U5.10
$1N1649: length 3.4
  Top Layer w0.254: C6.1 45.34,26.85 44.97,27.22 U3.9
$1N1727: length 5
  Top Layer w0.254: R3.1 R2.1 36.32,30.24 C8.2 34.48,30.35 R1.2
$1N1751: length 4.4
  Top Layer w0.254: U3.2 40.87,29.82 40.32,30.36 C5.1 39.43,30.28 R2.2
$1N1761: length 5.2
  Top Layer w0.254: U3.1 41.18,30.32 40.92,30.58 40.92,31.37 40.52,31.76 C5.2 39.46,31.7 R3.2
$1N1872: length 5.2
  Top Layer w0.254: R4.2 34.46,28.7 C8.1 36.12,28.84 36.36,28.6 ; 36.36,28.6 R6.1 ; 36.36,28.6 R5.1
$1N1876: length 4.4
  Top Layer w0.254: R5.2 39.41,28.85 C7.1 40.27,28.74 40.84,29.31 41.96,29.31 U3.3
$1N1880: length 5.2
  Top Layer w0.254: R6.2 39.43,27.43 C7.2 40.63,27.34 40.92,27.64 40.92,28.42 41.31,28.82 U3.4
$1N2295: length 3.3
  Top Layer w0.254: 60,28.87 60,27.38 60.46,26.92 C10.1
$1N2299: length 5.1
  Top Layer w0.254: 49.77,30.35 51.47,30.35 R8.1 R9.1 ; 49.77,30.35 C12.2 ; 49.77,30.35 R7.2
$1N2303: length 4.2
  Top Layer w0.254: U4.2 56.19,29.87 55.67,30.39 C9.1 54.62,30.28 R8.2
$1N2308: length 5
  Top Layer w0.254: R9.2 54.67,31.72 C9.2 55.71,31.79 56.06,31.45 56.06,30.76 56.45,30.37 U4.1
$1N2313: length 5
  Top Layer w0.254: R10.2 49.8,28.8 C12.1 49.9,28.83 R11.1 R12.1
$1N2317: length 4.2
  Top Layer w0.254: R11.2 54.67,28.83 C11.1 55.61,28.82 56.16,29.37 U4.3
$1N2322: length 4.9
  Top Layer w0.254: R12.2 54.65,27.38 C11.2 55.55,27.42 56.01,27.88 56.01,28.4 56.41,28.8 56.93,28.8 57,28.87
$1N2335: length 1.8
  Top Layer w0.254: R7.1 46,30.35 45.46,29.82 U3.11
$1N2345: length 1.8
  Top Layer w0.254: R10.1 46.52,28.78 46.02,28.78 45.49,29.32 U3.10
$1N2703: length 3.3
  Top Layer w0.254: U5.9 75.26,27.41 75.72,26.95 C14.1
$1N2707: length 5.1
  Top Layer w0.254: R15.1 R14.1 66.62,30.29 C16.2 64.83,30.33 R13.2
$1N2711: length 4.4
  Top Layer w0.254: R14.2 69.58,30.3 C13.1 70.86,30.42 71.43,29.84 U5.2
$1N2716: length 5.2
  Top Layer w0.254: U5.1 71.72,30.34 71.27,30.79 71.27,31.55 71,31.82 C13.2 69.66,31.78 R15.2
$1N2721: length 5.1
  Top Layer w0.254: R16.2 64.83,28.85 C16.1 66.57,28.89 R17.1 R18.1
$1N2725: length 4.3
  Top Layer w0.254: R17.2 69.68,28.83 C15.1 70.86,28.84 71.35,29.34 U5.3
$1N2730: length 5.1
  Top Layer w0.254: U5.4 71.64,28.84 71.27,28.47 71.27,27.79 70.93,27.44 69.7,27.44 69.64,27.38 R18.2
$1N2737: length 1.7
  Top Layer w0.254: U4.11 60.47,29.87 60.91,30.3 61.53,30.3 R13.1
$1N2741: length 1.8
  Top Layer w0.254: U4.10 60.45,29.37 60.96,28.85 R16.1
$2N441: length 8.3
  Top Layer w0.254: U9.1 11.23,14.15 12.21,13.17 12.21,10.4 12.51,10.1 14.81,10.1 U8.7
$2N691: length 10
  Top Layer w0.254: 14.59,12.36 14.7,12.25 16.37,12.25 ; 16.37,12.25 16.58,12.04 U8.4 ; 16.37,12.25 16.21,12.41 ; U8.9 U8.8 ; U8.9 14.82,9.11 v1(14.01,9.11) ; U8.9 U8.10 U8.11
  Bottom Layer w0.254: v1(15.37,12.31) 14.75,12.31 14.01,11.57 v1(14.01,9.11)
$2N1038: length 6.1
  Top Layer w0.254: U8.17 17.58,6.41 17.87,6.11 19.09,6.11 19.17,6.04 C45.2 19.17,4.56 18.92,4.31 17.72,4.31 17.44,4.03 R22.2
$2N1074: length 5.4
  Top Layer w0.254: U8.22 19.95,9.12 20.08,8.98 20.79,8.98 R23.2 R21.1 22.47,9.04 C44.1
$2N1166: length 6.4
  Top Layer w0.254: C46.2 14.3,3.5 R24.2 15.89,4.11 16.07,4.28 17.11,4.28 17.44,4.61 R22.1 17.44,5.83 17.08,6.19 U8.16
$2N1575: length 4.5
  Top Layer w0.254: C48.2 20.3,4.88 19.93,5.25 19.93,6.24 19.3,6.87 U8.18
$2N1585: length 3.6
  Top Layer w0.254: U8.21 19.61,8.62 19.78,8.45 19.78,7.43 20.16,7.05 C49.2
$2N3541: length 1.8
  Top Layer w0.254: U12.1 33.39,8.5 33.19,8.29 33.19,7.51 C53.1
$2N3548: length 3.9
  Top Layer w0.254: U12.7 39.41,9.16 39.72,9.46 C54.1

## Copper pours and planes (outline as drawn; the poured copper is in the pictures)
+5V_A on Top Layer: 57.45,28.53 62.29,28.53 62.29,22.98 57.45,22.98
+5V_A on Top Layer: 72.74,28.53 77.58,28.53 77.58,22.98 72.74,22.98
+5V_A on Top Layer: 42.47,28.5 47.31,28.5 47.31,22.95 42.47,22.95
+5V_A on Top Layer: 32.72,35.15 38.56,35.15 38.56,33.53 32.72,33.53
+5V_A on Top Layer: 33.85,9.59 35.37,9.59 35.37,5.07 33.85,5.07
+6V on Top Layer: 21.73,15.15 26.79,15.15 26.79,9.48 21.73,9.48
+6V on Top Layer: 26.74,13.55 33.57,13.55 33.57,11.72 26.74,11.72
-5V_A on Top Layer: 34.33,15.66 40.43,15.66 40.43,10.91 34.33,10.91
-5V_A on Top Layer: 58.09,34.74 62.16,34.74 62.16,30.64 58.09,30.64
-5V_A on Top Layer: 43.05,34.73 47.12,34.73 47.12,30.63 43.05,30.63
-5V_A on Top Layer: 73.33,34.71 77.4,34.71 77.4,30.61 73.33,30.61
-6V on Top Layer: 35.32,12.61 38.57,12.61 38.57,8.73 35.32,8.73
-6V on Top Layer: 8.59,14.13 11.78,14.13 11.78,9.92 8.59,9.92
DGND on Top Layer: 4,42.17 4,32.52 9.45,32.52 9.45,27.12 21.96,27.12 21.96,42.17
DGND on Bottom Layer: 3.94,42.32 3.94,32.66 9.38,32.66 9.38,27.27 21.89,27.27 21.89,42.32
GND on Top Layer: 0.38,17.96 44.27,17.96 44.27,0.43 0.38,0.43
GND on Top Layer: 13.93,16.1 17.76,16.1 17.76,10.43 13.93,10.43
GND on Top Layer: 22.61,42.19 22.61,25.5 27.99,20.12 87.66,20.12 87.66,42.57
GND on Bottom Layer: 22.61,42.29 22.61,24.54 0.51,24.54 0.51,0.43 87.68,0.43 87.71,0.46 87.71,42.57 22.89,42.57
GND on Inner1: 0,42.98 88.06,42.98 88.06,0 0,0
GND on Inner2: 0,42.98 88.06,42.98 88.06,0 0,0
VIN on Top Layer: 12.64,16.2 16.25,16.2 16.25,10.46 12.64,10.46
$2N487 on Top Layer: 11.55,23.99 22.55,23.99 22.55,16.54 11.55,16.54
$2N838 on Top Layer: 17.94,17.62 22.47,17.62 22.47,10.12 17.94,10.12
$2N1650 on Top Layer: 3.17,7.97 16.12,7.97 16.12,5.4 3.17,5.4

## Text on the board
Top Solder Mask Layer: 小李工作站 | 高性能信号源
